# Altium schematic sheet [2] BlockDiagram.SchDoc: =DocumentName
size A3; ENG_APP_DATE: --/--/--; DSN_APP_DATE: --/--/--; CHK_APP_DATE: --/--/--; Organization: ORGANIZATION; Address1: R. Aprígio Veloso, 882, Universitário; Address2: Campina Grande - PB; Address3: 58429-900; DocumentNumber: 2; Revision: -; SheetNumber: 2; SheetTotal: 9; ENG_DATE: --/--/--; DSN_DATE: --/--/--; CHK_DATE: --/--/--; SCH_SCALE: 1:1
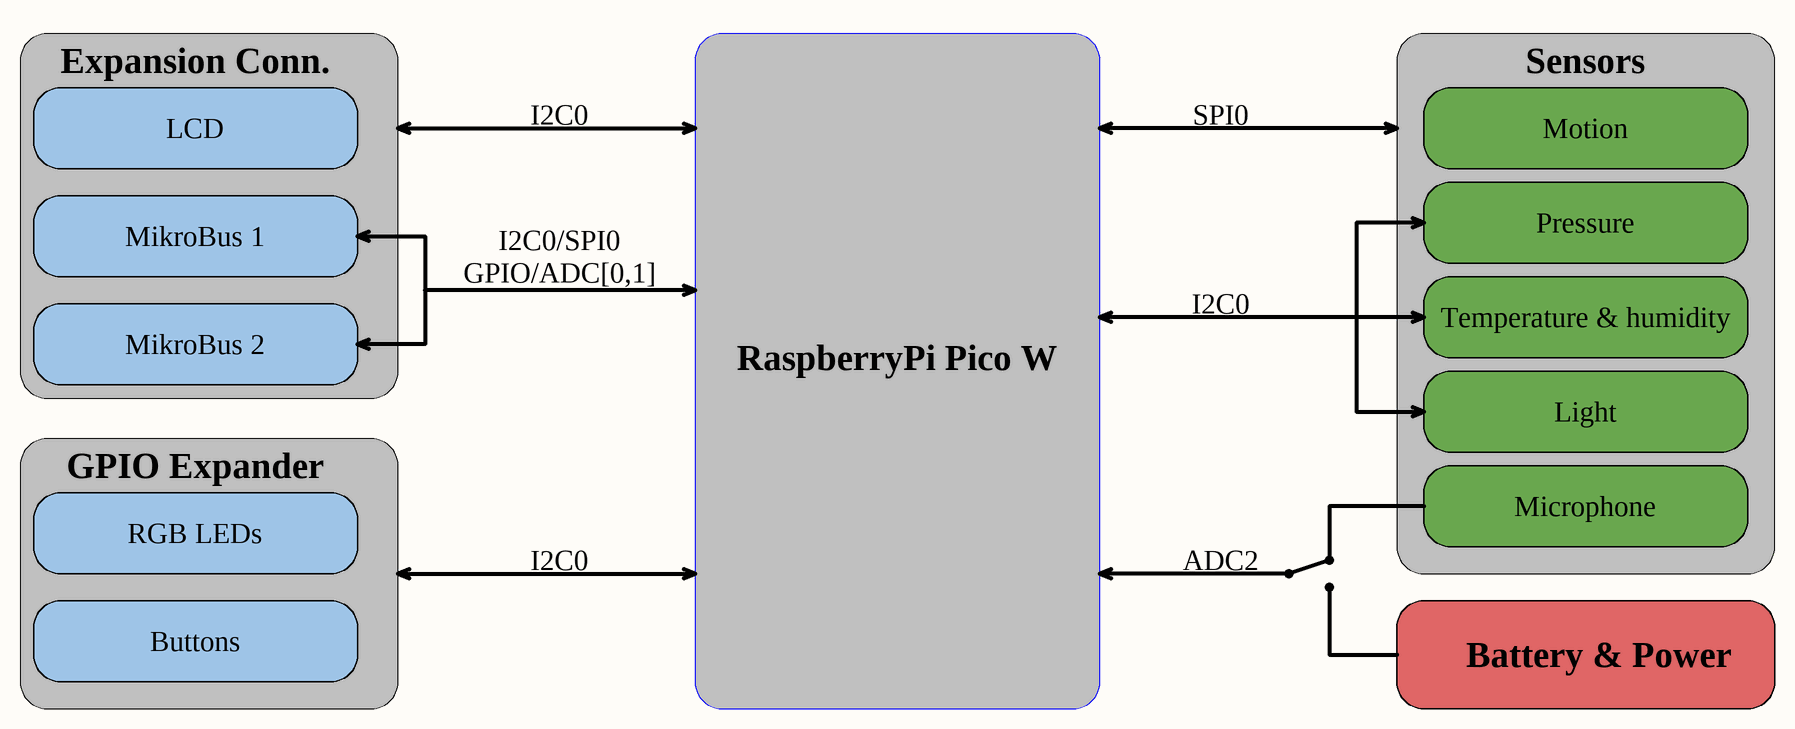
[diagram p0: [2] BlockDiagram.SchDoc]

## Notes on the sheet
- Expansion Conn.
- I2C0
- SPI0
- Sensors
- LCD
- Motion
- MikroBus 1
- Pressure
- MikroBus 2
- I2C0/SPI0
  GPIO/ADC[0,1]
- RaspberryPi Pico W
- Temperature & humidity
- Light
- GPIO Expander
- Microphone
- RGB LEDs
- ADC2
- Buttons
- Battery & Power
- REVISION
- DESCRIPTION
- DATE
- APPROVED
- ADDRESS
- PROJECT
- VERSION
- TITLE
- A3
- SIZE
- SCALE
- DOCUMENT NAME:
- DOCUMENT REVISION:
- OF
- SHEET:
- PROJECT REVISION: